# EasyEDA Pro project 高速运放.eprj

# Schematic Schematic1

## Sheets
1 P1: Create Date: 2023-07-20; Page Name: P1; Project Name: 高速运放; Schematic Name: Schematic1; Update Date: 2023-07-20; Company: 嘉立创EDA; Page Size: A4; Version: V1.0
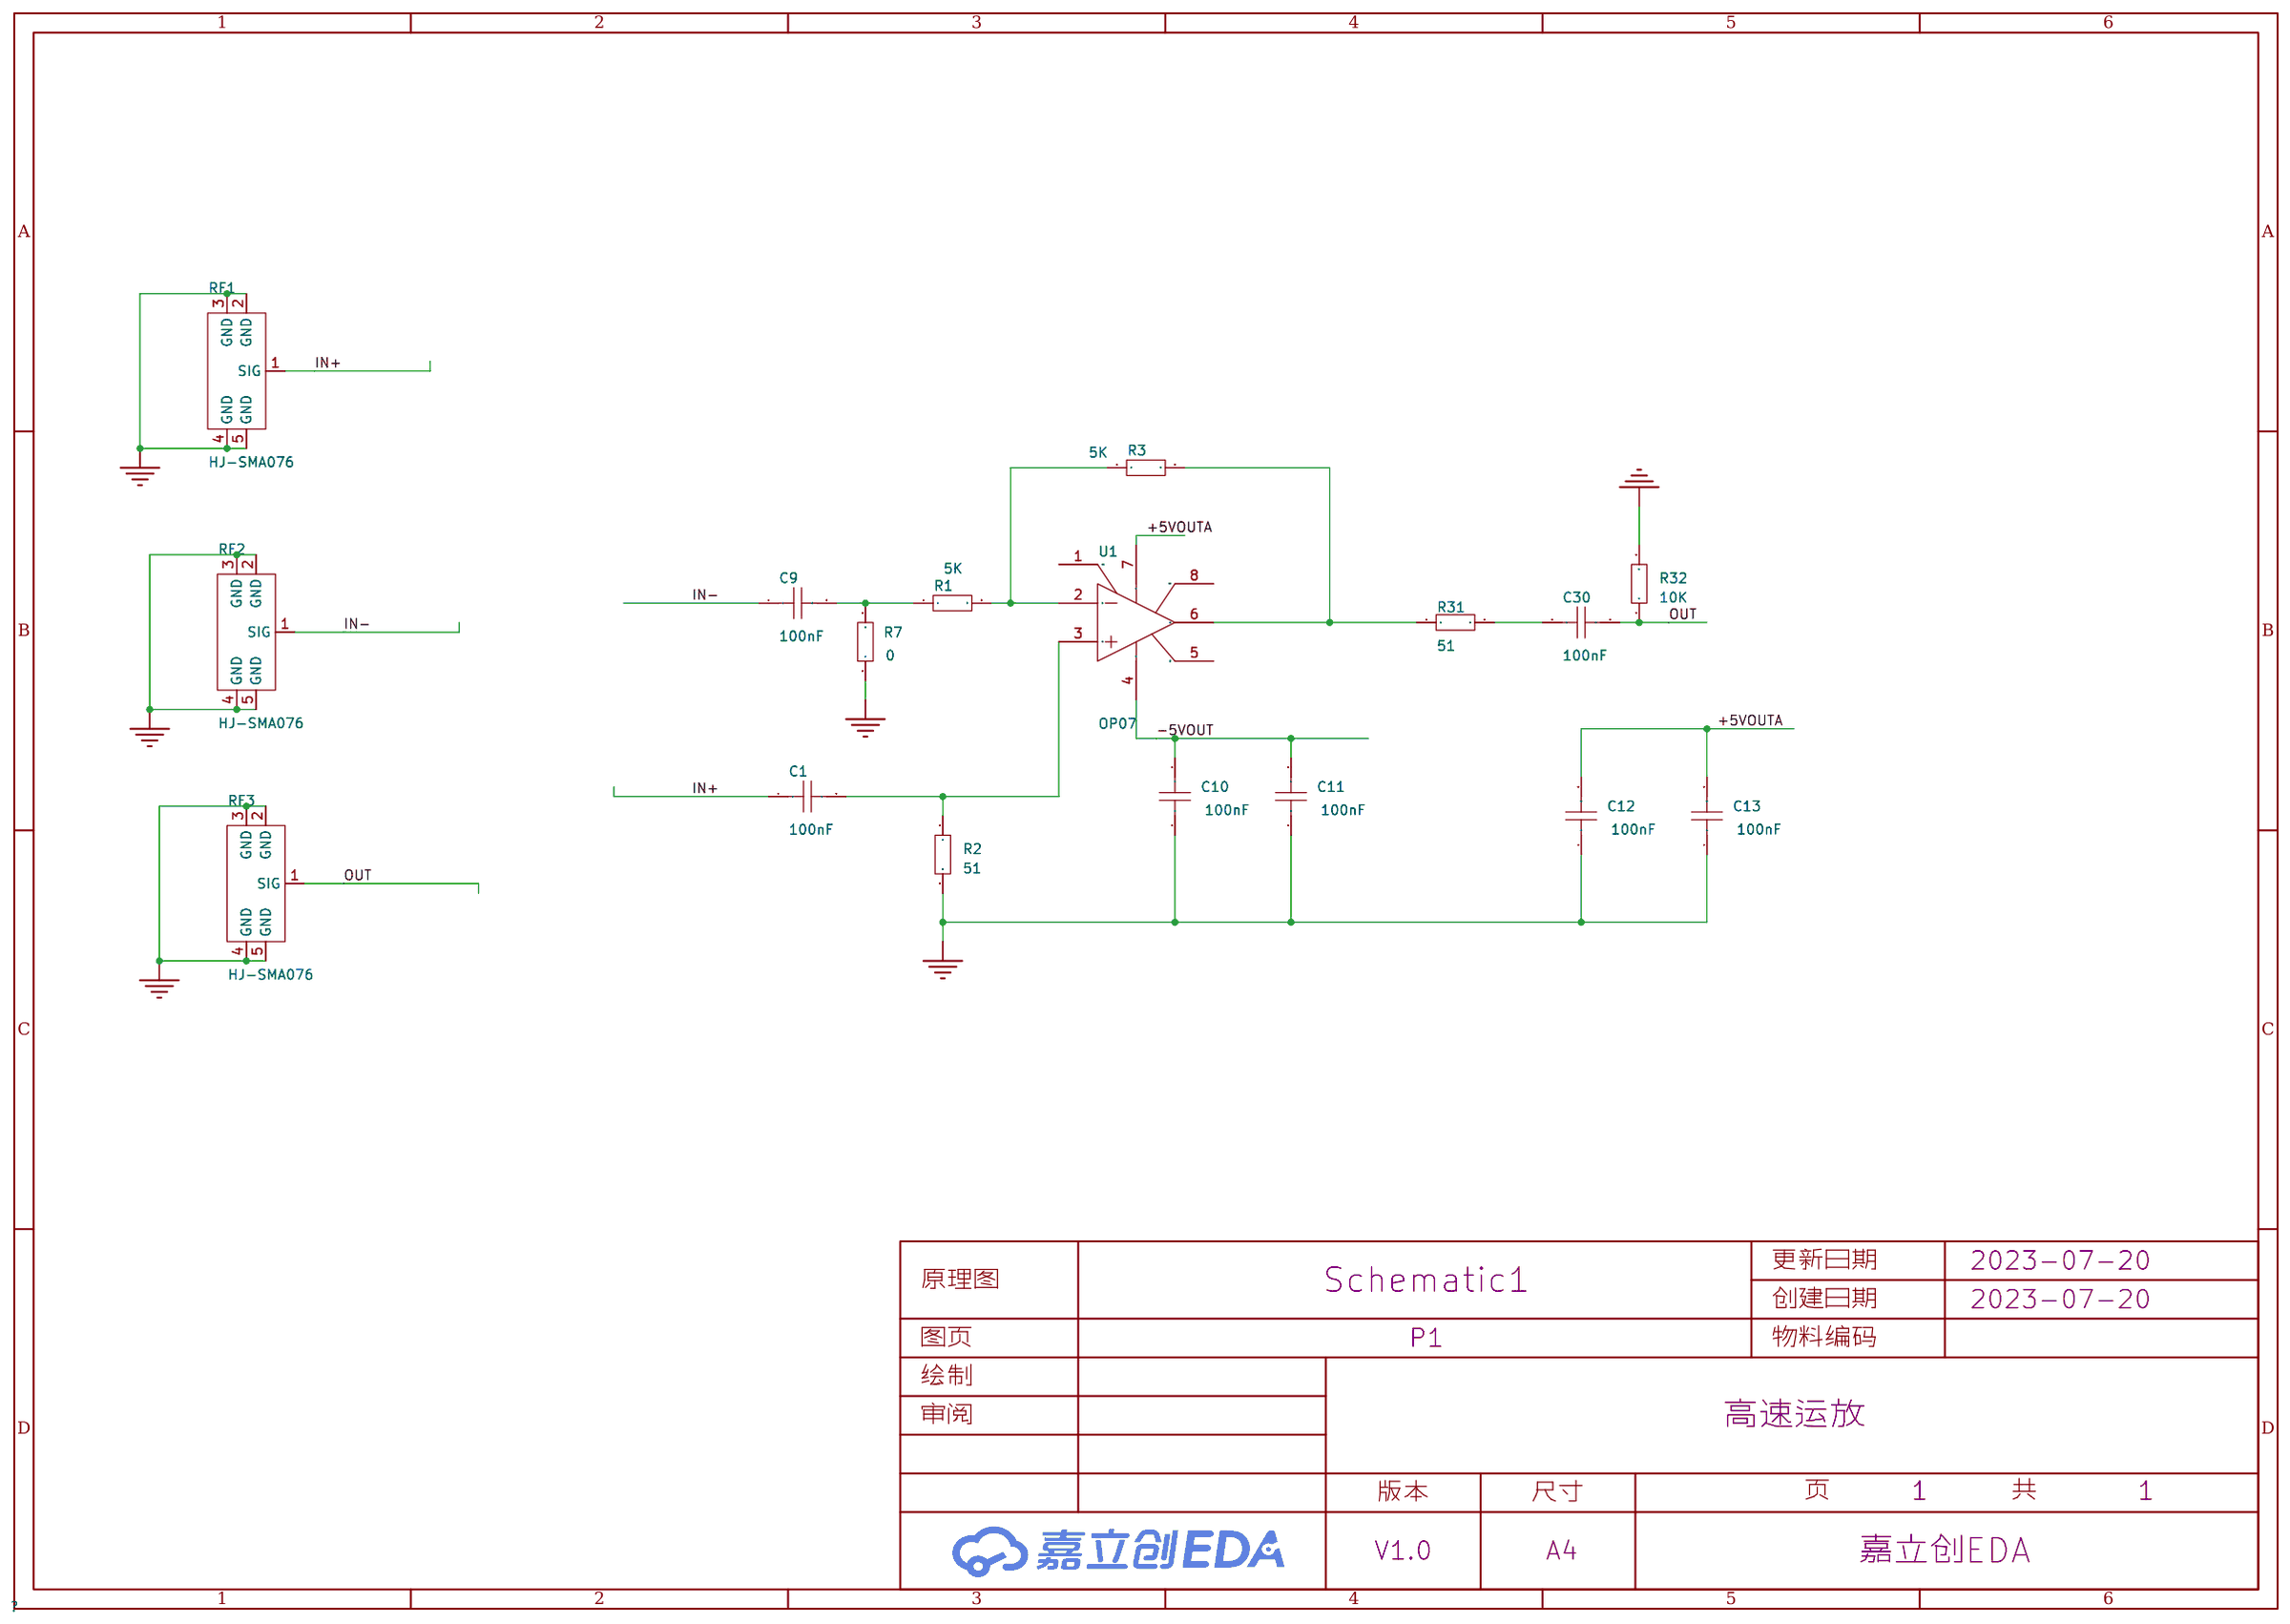
[diagram p0: P1]
2 power双: Page Name: power双
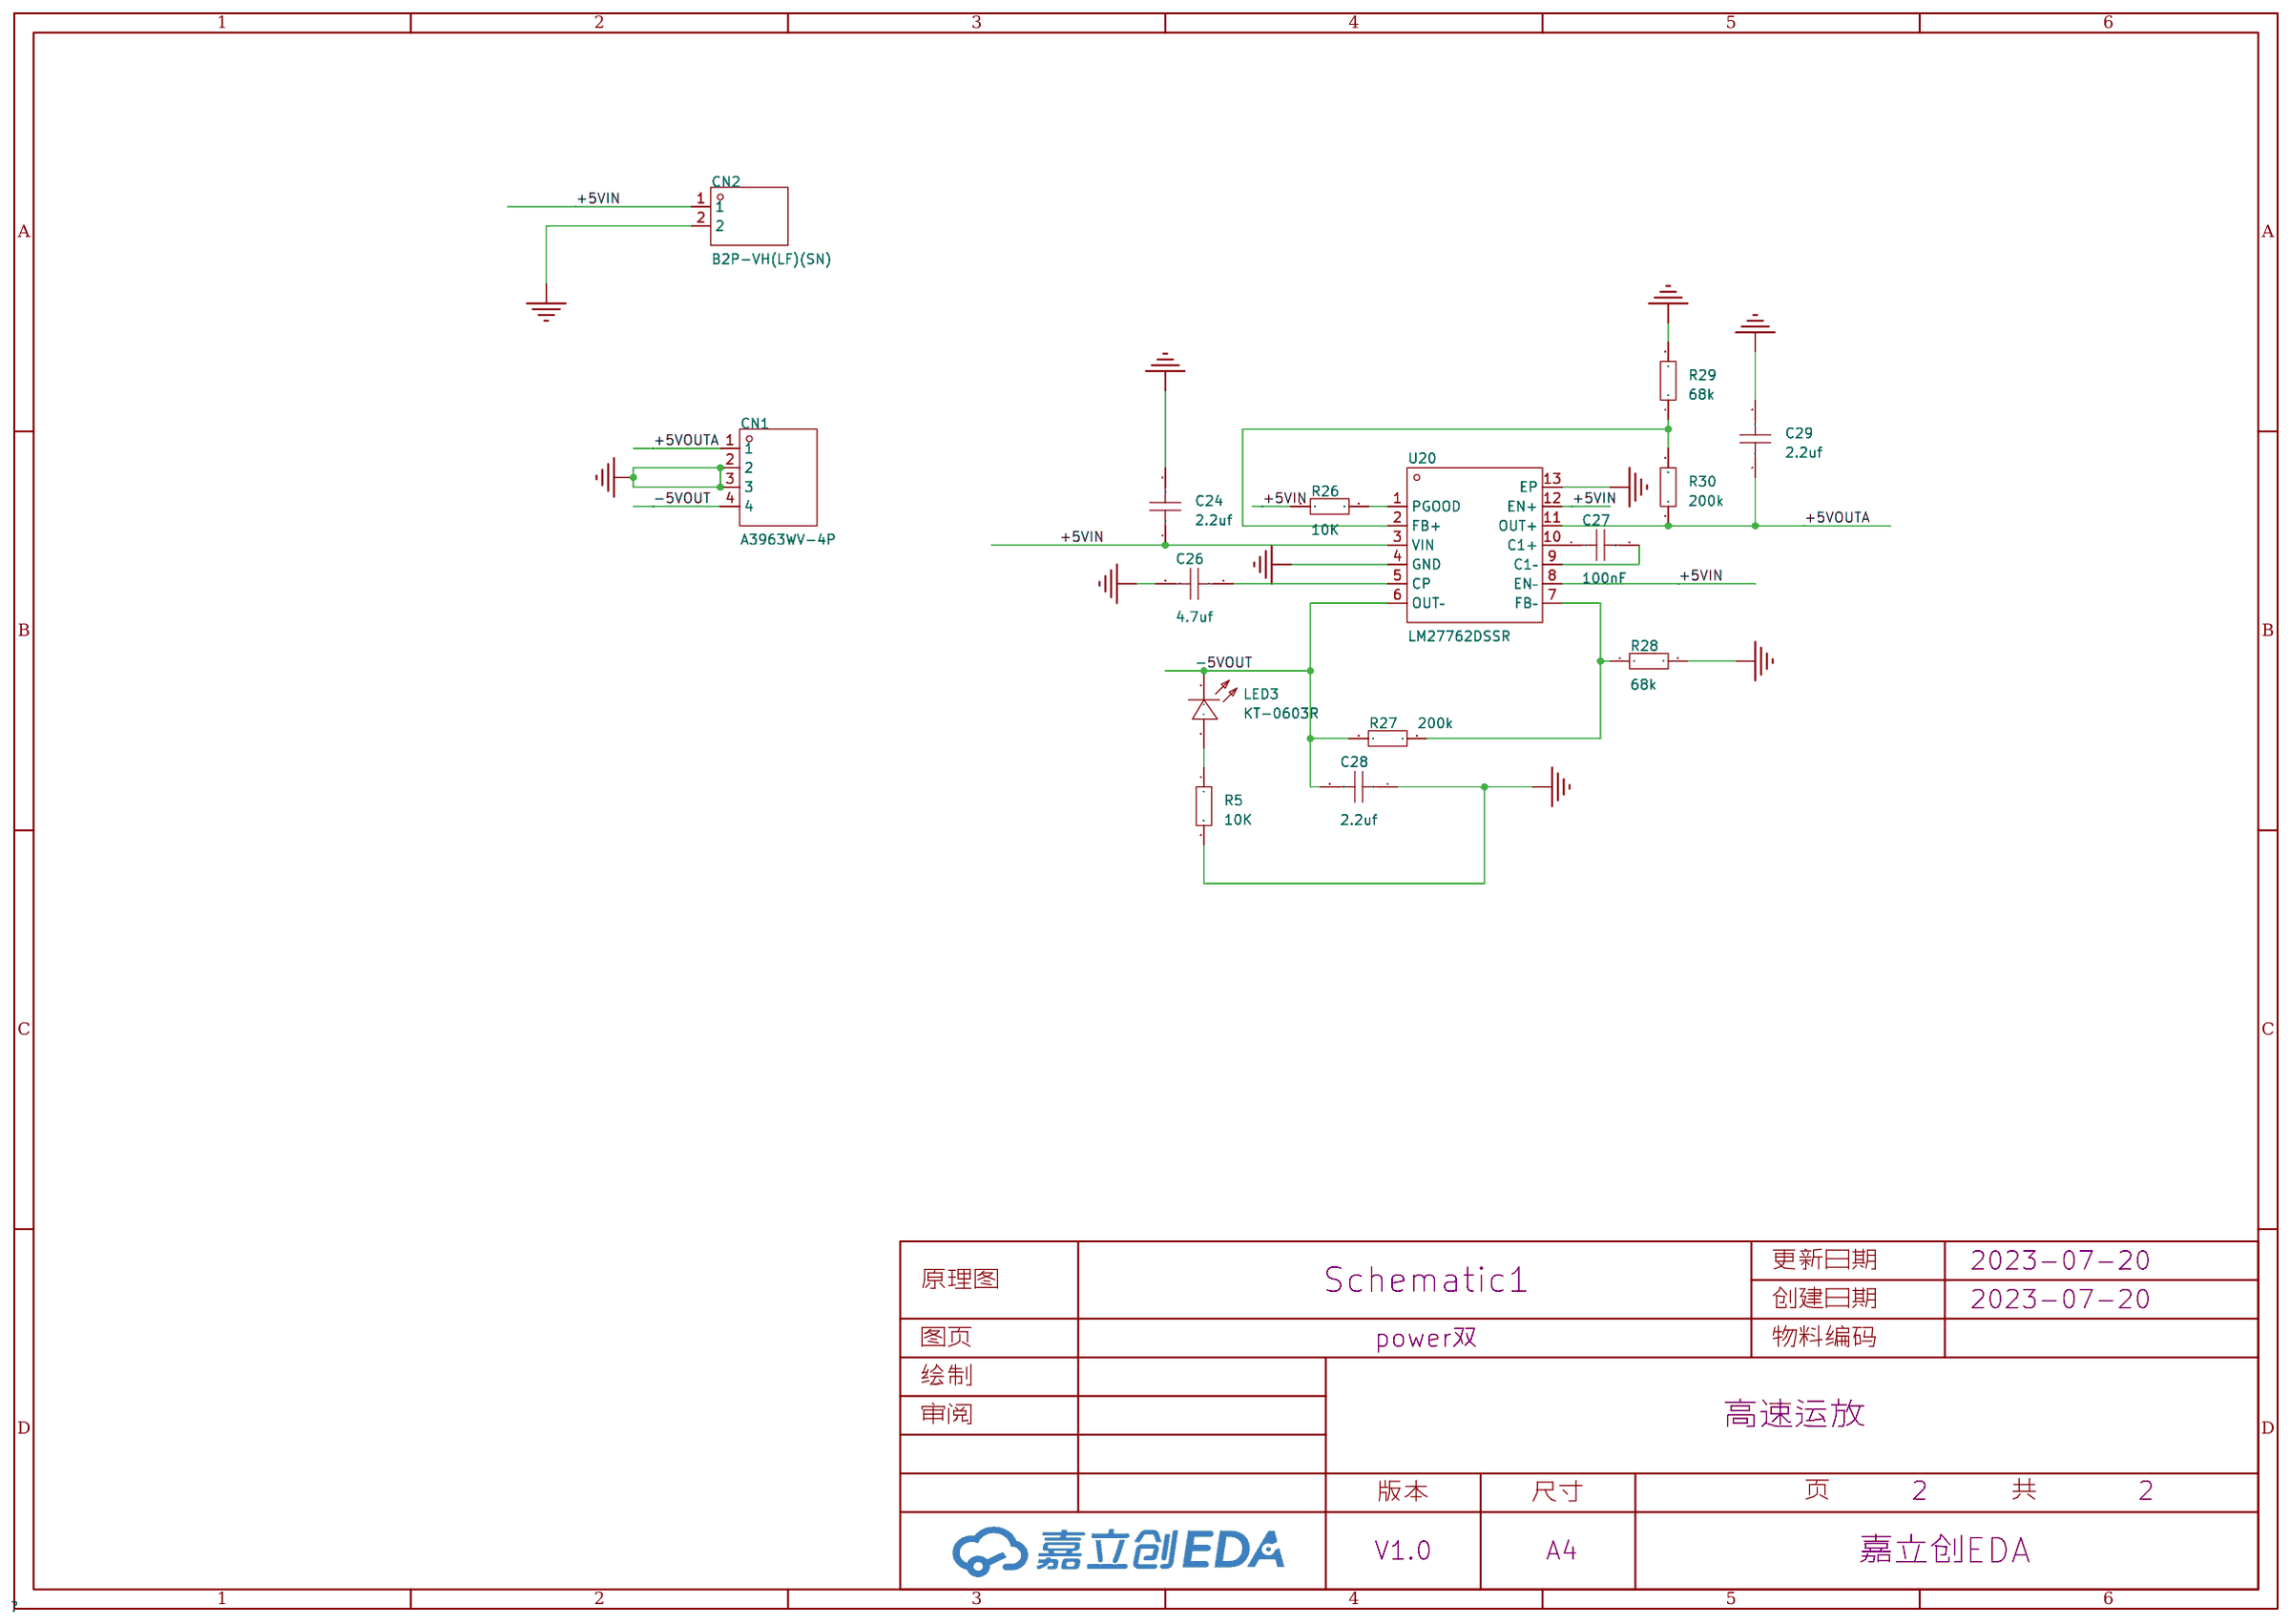
[diagram p1: power双]
3 P3: Create Date: 2023-08-04
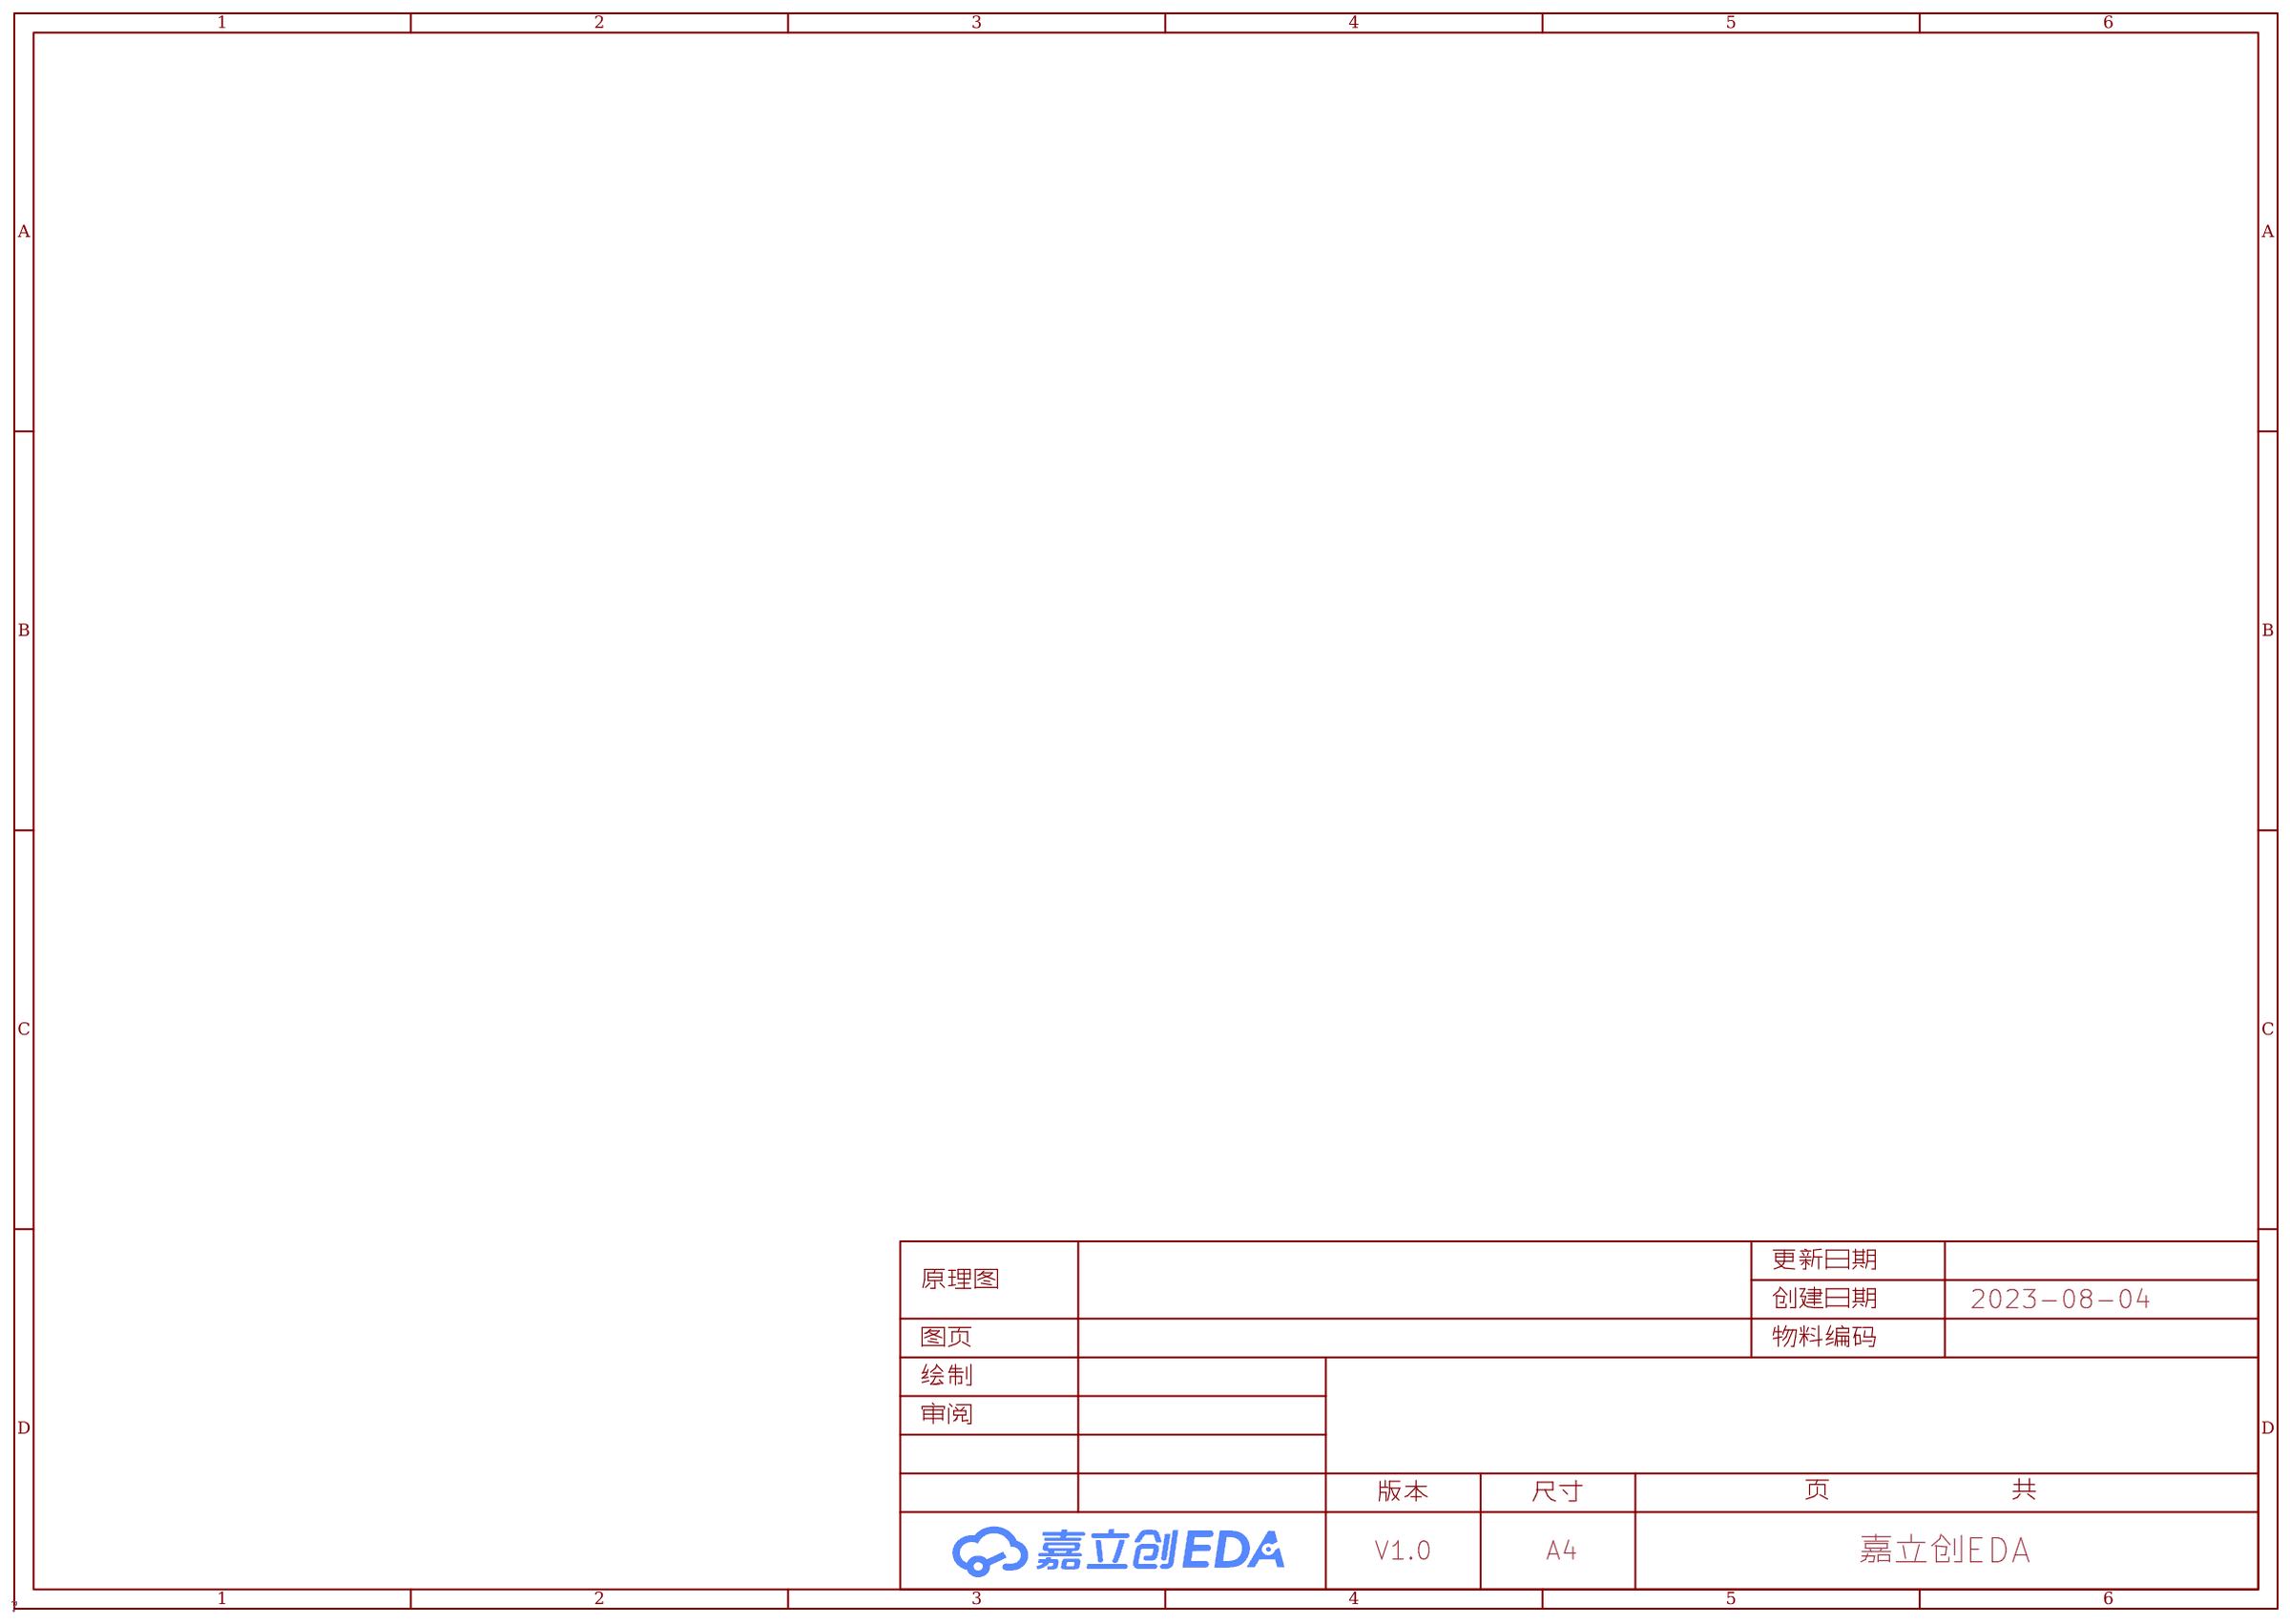
[diagram p2: P3]

## Parts
sheet P1
C1  100nF  [C0603]
C9  100nF  [C0603]
C10  100nF  [C0603]
C11  100nF  [C0603]
C12  100nF  [C0603]
C13  100nF  [C0603]
C30  100nF  [C0603]
R1  5K  [R0603]
R2  51  [R0603]
R3  5K  [R0603]
R7  0  [R0603]
R31  51  [R0603]
R32  10K  [R0603]
RF1  HJ-SMA076  [SMA-SMD_HJ-SMA076]
RF2  HJ-SMA076  [SMA-SMD_HJ-SMA076]
RF3  HJ-SMA076  [SMA-SMD_HJ-SMA076]
U1  OP07  [SOP-8_L4.9-W3.9-P1.27-LS6.0-BL]
sheet power双
C24  2.2uf  [C0603]
C26  4.7uf  [C0603]
C27  100nF  [C0603]
C28  2.2uf  [C0603]
C29  2.2uf  [C0603]
CN1  A3963WV-4P  [CONN-TH_A3963WV-4P]
CN2  B2P-VH(LF)(SN)  [CONN-TH_B2P-VH-LF-SN]
LED3  KT-0603R  [LED0603-RD]
R5  10K  [R0603]
R26  10K  [R0603]
R27  200k  [R0603]
R28  68k  [R0603]
R29  68k  [R0603]
R30  200k  [R0603]
U20  LM27762DSSR  [WSON-12_L3.0-W2.0-P0.50-BL-EP]

## Library data of the parts
C1 C9-C13 C24 C26-C30 = CAP_0603: Supplier Footprint: 0603
R1-R3 R5 R7 R26-R32 = Res_0603: Supplier Footprint: 0603
RF1-RF3 = HJ-SMA076: 连接器类型:板端;射频系列:SMA;接口类型:内孔;端口数量:1;阻抗:-;频率-最大值:-;样式:偏脚;接口直径:-;接口长度/高度:-;工作温度范围:-;; LCSC Part Name: SMA 内孔 偏脚 异形SMA母头母针; Supplier Part: C1509221; Manufacturer: 皇捷; Supplier Footprint: 插件; JLCPCB Part Class: 扩展库; Datasheet: https://atta.szlcsc.com/upload/public/pdf/source/20201224/C1509221_82B8BEE71B057F9D96B3EC7FCC7602D2.pdf; Supplier: LCSC; Connector Type: 板端; RF Series: SMA; Interface Type: 内孔; Number of Ports: 1; Style: 偏脚
U1 = OP07: 放大器组数:-;; Supplier Part: C1508997; Manufacturer: 杭州瑞盟; Supplier Footprint: SOP-8; JLCPCB Part Class: 扩展库; Datasheet: https://atta.szlcsc.com/upload/public/pdf/source/20201221/C1508997_31DB1D3DFE7BEFB064DC1C62AA82E0AA.pdf; Supplier: LCSC
CN1 = A3963WV-4P: 参考系列:VH;间距:3.96mm;插针结构:1x4P;排数:1;每排PIN数:4;行距:-;安装方式:-;触头材质:黄铜;; LCSC Part Name: VH 3.96mm 1x4P; Supplier Part: C239411; Manufacturer: CJT(长江连接器); Supplier Footprint: 直插,P=3.96mm; JLCPCB Part Class: Extended Part; Datasheet: https://atta.szlcsc.com/upload/public/pdf/source/20180725/C239411_2B583D17F8A06D9E72A993AEB9CC7416.pdf; Supplier: LCSC; Reference Series: VH; Pitch: 3.96mm; Pins Structure: 1x4P; Number of Rows: 1; Number of PINs Per Row: 4; Contact Material: 黄铜
CN2 = B2P-VH (LF)(SN): 参考系列:VH;间距:3.96mm;插针结构:1x2P;排数:1;每排PIN数:2;行距:-;安装方式:-;触头材质:黄铜;; LCSC Part Name: VH 3.96mm 1x2P 直插; Supplier Part: C160315; Manufacturer: JST; Supplier Footprint: 插件,P=3.96mm; JLCPCB Part Class: Extended Part; Datasheet: https://atta.szlcsc.com/upload/public/pdf/source/20180420/C160315_19C451141449BB9E1CAF8D49BAD03192.pdf; Supplier: LCSC; Reference Series: VH; Pitch: 3.96mm; Pins Structure: 1x2P; Number of Rows: 1; Number of PINs Per Row: 2; Contact Material: 黄铜
LED3 = KT-0603R: 发光颜色:红灯;二极管配置:-;透镜颜色:-;主波长:-;色温:-;功率:-;发光角度:-;安装方式:-;工作温度:-40℃~+85℃;; LCSC Part Name: 0603 红灯 高亮; Supplier Part: C2286; Manufacturer: KENTO; Supplier Footprint: 0603; JLCPCB Part Class: 基础库; Datasheet: https://atta.szlcsc.com/upload/public/pdf/source/20160616/1466072038404.pdf; Supplier: LCSC; Emitted Color: 红灯; Operating Temperature: -40℃~+85℃
U20 = LM27762DSSR: 功能类型:电荷泵;同步整流:否;输出通道数:2;拓扑结构:-;输入电压:2.7V~5.5V;输出电压:-5V~-1.5V；1.5V~5V;输出电流(最大值):250mA;开关频率:2.3MHz;; LCSC Part Name: 电荷泵 Vin=2.7V~5.5V Vout=1.5V~5V Vout=-5V~-1.5V 250mA; Supplier Part: C473398; Manufacturer: TI(德州仪器); Supplier Footprint: WSON-12; JLCPCB Part Class: 扩展库; Datasheet: https://atta.szlcsc.com/upload/public/pdf/source/20200102/C473398_D2E7C41775171187D808CA6E0151F4D2.pdf; Supplier: LCSC; Function: 电荷泵; Synchronous Rectification: 否; Number of Outputs: 2; Input Voltage: 2.7V~5.5V; Output Voltage: -5V~-1.5V；1.5V~5V; Output Current (Max): 250mA; Switching Frequency: 2.3MHz

## Nets
+5VIN: C24.1 CN2.1 R26.1 U20.3(VIN) U20.8(EN–) U20.12(EN+)
+5VOUTA: C12.2 C13.2 C29.1 CN1.1 R30.1 U1.7(V+) U20.11(OUT+)
-5VOUT: C10.2 C11.2 C28.2 CN1.4 LED3.1(K) R27.1 U1.4(V-) U20.6(OUT–)
GND: C10.1 C11.1 C12.1 C13.1 C24.2 C26.2 C28.1 C29.2 CN1.2 CN1.3 CN2.2 R2.2 R5.2 R7.1 R28.2 R29.2 R32.2 RF1.2(GND) RF1.3(GND) RF1.4(GND) RF1.5(GND) RF2.2(GND) RF2.3(GND) RF2.4(GND) RF2.5(GND) RF3.2(GND) RF3.3(GND) RF3.4(GND) RF3.5(GND) U20.4(GND) U20.13(EP)
IN+: C1.1 RF1.1(SIG)
IN-: C9.1 RF2.1(SIG)
OUT: C30.2 R32.1 RF3.1(SIG)
$1N351: C9.2 R1.1 R7.2
$1N845: C30.1 R31.1
$2N500: C26.1 U20.5(CP)
$2N501: C27.1 U20.10(C1+)
$2N502: C27.2 U20.9(C1–)
$2N513: R29.1 R30.2 U20.2(FB+)
$2N514: R26.2 U20.1(PGOOD)
$2N519: R27.2 R28.1 U20.7(FB–)
$2N525: LED3.2(A) R5.1
Net-(C1-2): C1.2 R2.1 U1.3(IN+)
Net-(R1-2): R1.2 R3.1 U1.2(IN-)
Net-(R3-2): R3.2 R31.2 U1.6(OUT)

Not connected (* = marked no-connect by the designer): U1 1(VOS TRIM) 5(NC) 8(VOS TRIM)

# Board PCB1
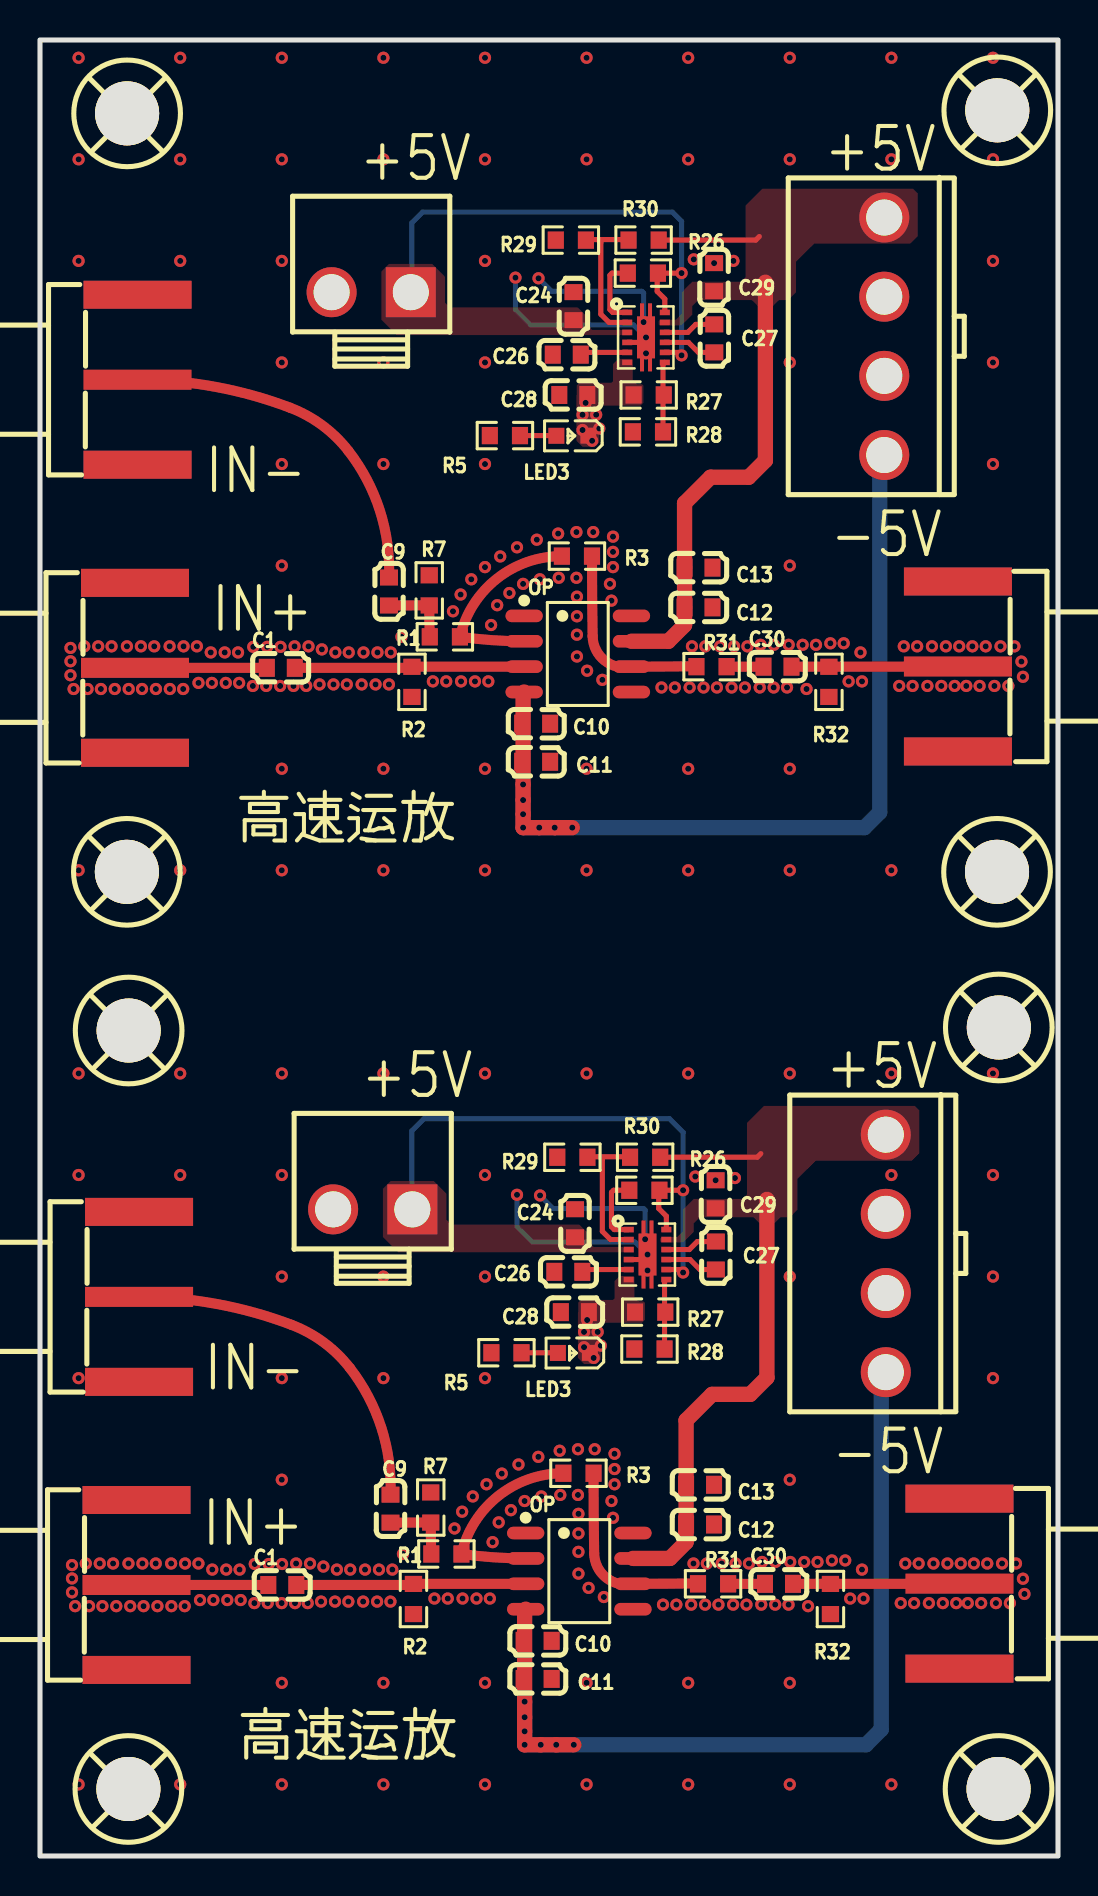
[diagram p3: board, top side]
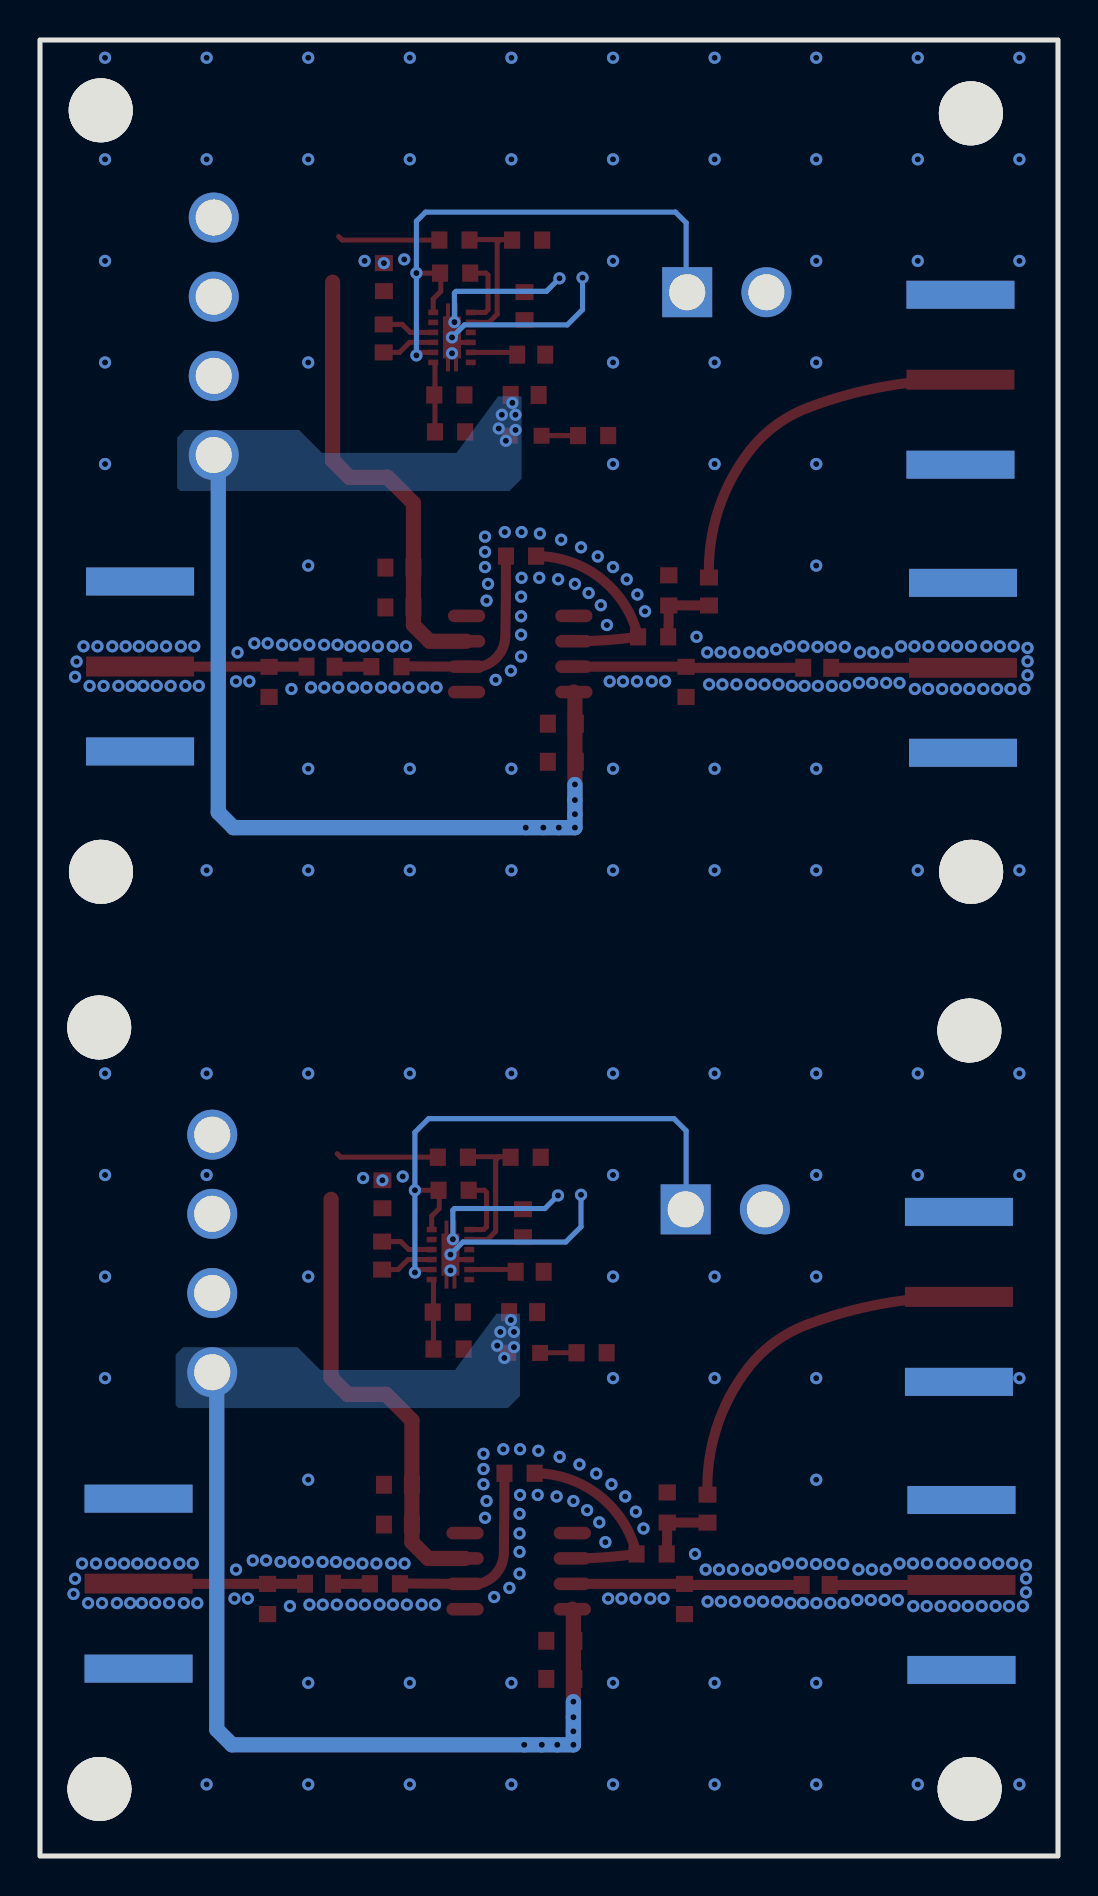
[diagram p4: board, bottom side, seen from below]

Outline 50.9 x 90.83 mm; copper layers: Top Layer, Bottom Layer. Coordinates in mm from the lower left corner of the outline.
Outline path: rectangle 0,90.83 50.9,0
Stack: Top Layer 0.035mm / Dielectric1 1.51mm FR4 er 4.5 / Bottom Layer 0.035mm

## Design rules (mm)
template: 自定义配置
spacing copperThickness1oz (default): track to track 0.102, other pairs 0.152 to 0.3
spacing copperThickness2oz: track to track 0.203, other pairs 0.152 to 0.3
track width copperThickness1oz (default): min 0.127, default 0.254, max 2.54
track width copperThickness2oz: min 0.203, default 0.254, max 2.54
differential pair differentialPair (default): width min 0.127, default 0.254, max 2.54; gap min 0.152, default 0.152
via viaSize (default): diameter min 0.5, default 0.61, max 10; hole min 0.3, default 0.305, max 6.299

## Placement (name value [footprint] x y rotation side)
C1  100nF  [C0603]  12.12 13.56 0 top
C1#2  -  [C0603]  12.04 59.43 0 top
C9  100nF  [C0603]  17.53 17.37 270 top
C9#2  -  [C0603]  17.45 63.25 270 top
C10  100nF  [C0603]  24.88 10.76 180 top
C10#2  -  [C0603]  24.81 56.64 180 top
C11  100nF  [C0603]  24.88 8.86 180 top
C11#2  -  [C0603]  24.81 54.73 180 top
C12  100nF  [C0603]  33 16.58 180 top
C12#2  -  [C0603]  32.93 62.45 180 top
C13  100nF  [C0603]  32.93 64.44 180 top
C13#2  -  [C0603]  33 18.57 180 top
C24  2.2uf  [C0603]  26.75 31.65 90 top
C24#2  -  [C0603]  26.68 77.52 90 top
C26  4.7uf  [C0603]  26.42 29.22 180 top
C26#2  -  [C0603]  26.34 75.09 180 top
C27  100nF  [C0603]  33.79 30.03 270 top
C27#2  -  [C0603]  33.72 75.9 270 top
C28  2.2uf  [C0603]  26.74 27.2 0 top
C28#2  -  [C0603]  26.67 73.08 0 top
C29  2.2uf  [C0603]  33.78 33.1 90 top
C29#2  -  [C0603]  33.71 78.97 90 top
C30  100nF  [C0603]  36.87 59.49 0 top
C30#2  -  [C0603]  36.95 13.61 0 top
CN1  A3963WV-4P  [CONN-TH_A3963WV-4P]  42.29 30.14 270 top
CN1#2  -  [CONN-TH_A3963WV-4P]  42.22 76.01 270 top
CN2  B2P-VH(LF)(SN)  [CONN-TH_B2P-VH-LF-SN]  16.64 32.34 180 top
CN2#2  -  [CONN-TH_B2P-VH-LF-SN]  16.56 78.22 180 top
LED3  KT-0603R  [LED0603-RD]  26.7 25.16 180 top
LED3#2  -  [LED0603-RD]  26.62 71.04 180 top
OP  -  [SOP-8_L4.9-W3.9-P1.27-LS6.0-BL]  26.89 60.12 270 top
OP#2  -  [SOP-8_L4.9-W3.9-P1.27-LS6.0-BL]  26.97 14.25 270 top
R1  5K  [R0603]  20.24 60.98 0 top
R1#2  -  [R0603]  20.32 15.11 0 top
R2  51  [R0603]  18.67 12.85 270 top
R2#2  -  [R0603]  18.6 58.73 270 top
R3  5K  [R0603]  26.92 19.14 0 top
R3#2  -  [R0603]  26.85 65.02 0 top
R5  10K  [R0603]  23.32 25.17 180 top
R5#2  -  [R0603]  23.25 71.04 180 top
R7  0  [R0603]  19.54 17.43 270 top
R7#2  -  [R0603]  19.46 63.3 270 top
R26  10K  [R0603]  30.15 79.17 180 top
R26#2  -  [R0603]  30.22 33.3 180 top
R27  200k  [R0603]  30.44 73.08 0 top
R27#2  -  [R0603]  30.51 27.2 0 top
R28  68k  [R0603]  30.47 25.36 180 top
R28#2  -  [R0603]  30.4 71.23 180 top
R29  68k  [R0603]  26.62 34.95 180 top
R29#2  -  [R0603]  26.54 80.82 180 top
R30  200k  [R0603]  30.26 34.95 180 top
R30#2  -  [R0603]  30.18 80.82 180 top
R31  51  [R0603]  33.58 59.49 180 top
R31#2  -  [R0603]  33.66 13.61 180 top
R32  10K  [R0603]  39.45 58.73 270 top
R32#2  -  [R0603]  39.52 12.85 270 top
RF1  HJ-SMA076  [SMA-SMD_HJ-SMA076]  4.75 59.43 90 top
RF1#2  -  [SMA-SMD_HJ-SMA076]  4.83 13.56 90 top
RF2  HJ-SMA076  [SMA-SMD_HJ-SMA076]  4.88 73.84 90 top
RF2#2  -  [SMA-SMD_HJ-SMA076]  4.95 27.97 90 top
RF3  HJ-SMA076  [SMA-SMD_HJ-SMA076]  45.9 59.5 270 top
RF3#2  -  [SMA-SMD_HJ-SMA076]  45.97 13.62 270 top
TP1  -  [M3螺丝]  47.99 3.29 0 top
TP1#2  -  [M3螺丝]  4.48 3.29 0 top
TP1#3  -  [M3螺丝]  4.5 41.22 0 top
TP1#4  -  [M3螺丝]  4.42 87.1 0 top
TP1#5  -  [M3螺丝]  4.41 49.16 0 top
TP1#6  -  [M3螺丝]  47.92 49.16 0 top
TP2  -  [M3螺丝]  48.01 41.38 0 top
TP2#2  -  [M3螺丝]  47.93 87.25 0 top
U20  LM27762DSSR  [WSON-12_L3.0-W2.0-P0.50-BL-EP]  30.3 75.95 270 top
U20#2  -  [WSON-12_L3.0-W2.0-P0.50-BL-EP]  30.38 30.08 270 top

## Footprints (pads in the part's own frame, mm; a bottom-side part is the same pattern mirrored in y, then rotated)
C0603
  rect 0.8x0.9 smd: 1(-0.7,0) 2(0.7,0)
CONN-TH_A3963WV-4P
  round 2.5 hole 1.8: 1(-5.94,0) 2(-1.98,0) 3(1.98,0) 4(5.94,0)
CONN-TH_B2P-VH-LF-SN
  rect 2.5x2.5 hole 1.8: 1(-1.98,0)
  round 2.5 hole 1.8: 2(1.98,0)
LED0603-RD
  rect 0.8x0.8 smd: 1(-0.799,-0.004) 2(0.799,0.004)
M3螺丝
  round 3.2 hole 3.2: 1(-0.064,0.064)
R0603
  rect 0.806x0.864 smd: 1(-0.753,0) 2(0.753,0)
SMA-SMD_HJ-SMA076
  rect 1x5.4 smd: 1(0,0)
  rect 1.4x5.4 smd: 2(-4.25,0) 3(4.25,0)
  rect 1.4x5.4 smd far side: 4(-4.25,0) 5(4.25,0)
SOP-8_L4.9-W3.9-P1.27-LS6.0-BL
  oval 0.63x1.865 smd: 1(-1.905,-2.683) 2(-0.635,-2.683) 3(0.635,-2.683) 4(1.905,-2.683) 5(1.905,2.683) 6(0.635,2.683) 7(-0.635,2.683) 8(-1.905,2.683)
WSON-12_L3.0-W2.0-P0.50-BL-EP
  rect 0.28x0.5 smd: 1(-1.25,-0.94) 2(-0.75,-0.94) 3(-0.25,-0.94) 4(0.25,-0.94) 5(0.75,-0.94) 6(1.25,-0.94) 7(1.25,0.94) 8(0.75,0.94) 9(0.25,0.94) 10(-0.25,0.94) 11(-0.75,0.94) 12(-1.25,0.94)
  custom 3.4x0.9 smd: 13(0,0)

## Nets
+5VIN: C24.1 C24#2.1 CN2.1 CN2#2.1 R26.1 R26#2.1 U20.3 U20.8 U20.12 U20#2.3 U20#2.8 U20#2.12
+5VOUTA: C12.2 C12#2.2 C13.2 C13#2.2 C29.1 C29#2.1 CN1.1 CN1#2.1 OP.7 OP#2.7 R30.1 R30#2.1 U20.11 U20#2.11
-5VOUT: C10.2 C10#2.2 C11.2 C11#2.2 C28.2 C28#2.2 CN1.4 CN1#2.4 LED3.1 LED3#2.1 OP.4 OP#2.4 R27.1 R27#2.1 U20.6 U20#2.6
GND: C10.1 C10#2.1 C11.1 C11#2.1 C12.1 C12#2.1 C13.1 C13#2.1 C24.2 C24#2.2 C26.2 C26#2.2 C28.1 C28#2.1 C29.2 C29#2.2 CN1.2 CN1.3 CN1#2.2 CN1#2.3 CN2.2 CN2#2.2 R2.2 R2#2.2 R5.2 R5#2.2 R7.1 R7#2.1 R28.2 R28#2.2 R29.2 R29#2.2 R32.2 R32#2.2 RF1.2 RF1.3 RF1.4 RF1.5 RF1#2.2 RF1#2.3 RF1#2.4 RF1#2.5 RF2.2 RF2.3 RF2.4 RF2.5 RF2#2.2 RF2#2.3 RF2#2.4 RF2#2.5 RF3.2 RF3.3 RF3.4 RF3.5 RF3#2.2 RF3#2.3 RF3#2.4 RF3#2.5 U20.4 U20.13 U20#2.4 U20#2.13
IN+: C1.1 C1#2.1 RF1.1 RF1#2.1
IN-: C9.1 C9#2.1 RF2.1 RF2#2.1
OUT: C30.2 C30#2.2 R32.1 R32#2.1 RF3.1 RF3#2.1
$1N351: C9.2 C9#2.2 R1.1 R1#2.1 R7.2 R7#2.2
$1N353: C1.2 C1#2.2 OP.3 OP#2.3 R2.1 R2#2.1
$1N484: OP.2 OP#2.2 R1.2 R1#2.2 R3.1 R3#2.1
$1N492: OP.6 OP#2.6 R3.2 R3#2.2 R31.2 R31#2.2
$1N845: C30.1 C30#2.1 R31.1 R31#2.1
$2N500: C26.1 C26#2.1 U20.5 U20#2.5
$2N501: C27.1 C27#2.1 U20.10 U20#2.10
$2N502: C27.2 C27#2.2 U20.9 U20#2.9
$2N513: R29.1 R29#2.1 R30.2 R30#2.2 U20.2 U20#2.2
$2N514: R26.2 R26#2.2 U20.1 U20#2.1
$2N519: R27.2 R27#2.2 R28.1 R28#2.1 U20.7 U20#2.7
$2N525: LED3.2 LED3#2.2 R5.1 R5#2.1

Pads without a net: OP 1 5 8; OP#2 1 5 8; TP1 1; TP1#2 1; TP1#3 1; TP1#4 1; TP1#5 1; TP1#6 1; TP2 1; TP2#2 1

## Via types
v1: diameter 0.61, hole 0.305, Top Layer to Bottom Layer, 400 vias

## Routing (per net, layer and track width the routed paths; a pad name or vN(x,y) marks a point on that pad's centre or on a via; arc(x,y) is an arc through that point)
+5VIN: length 57.6
  Top Layer w0.254: v1(32.16,29.18) 32.01,29.33 U20#2.8 ; U20.12 31.24,77.88 30.86,78.26 30.86,79.13 R26.1 32.08,79.17 ; 32.16,33.3 R26#2.1 30.94,33.26 30.94,32.38 31.32,32 U20#2.12 ; U20.8 31.93,75.2 v1(32.08,75.06)
  Bottom Layer w0.254: CN2#2.1 18.59,78.27 18.59,81.69 19.13,82.22 31.62,82.22 32.08,81.76 v1(32.08,79.17) v1(32.08,75.06) ; CN2.1 18.59,32.37 18.59,36.27 19.2,36.88 31.47,36.88 32.16,36.19 v1(32.16,33.3) v1(32.16,29.18)
+5VOUTA: length 56.1
  Top Layer w0.254: 35.97,81 35.79,80.82 R30#2.1 ; R30.1 35.87,34.95 36.04,35.13
  Top Layer w0.762: 36.35,32.84 36.35,23.93 35.51,23.09 33.6,23.09 32.31,21.79 C13#2.2 C12.2 32.31,15.69 31.5,14.88 OP#2.7 ; 36.27,78.71 36.27,69.8 35.43,68.96 33.53,68.96 32.23,67.66 C13.2 C12#2.2 32.23,61.57 31.42,60.76 29.57,60.76
-5VOUT: length 102
  Top Layer w0.503: C11#2.2 C10#2.2 24.11,58.12 24.16,58.16 ; C11.2 C10.2 24.18,12.24 24.23,12.29
  Top Layer w0.762: v1(26.69,5.56) v1(25.81,5.56) v1(25.04,5.56) v1(24.23,5.56) v1(24.23,6.24) v1(24.23,6.94) v1(24.23,7.72) 24.23,12.29 OP#2.4 ; v1(26.61,51.43) v1(25.74,51.43) v1(24.96,51.43) v1(24.16,51.43) v1(24.16,52.11) v1(24.16,52.81) v1(24.16,53.59) 24.16,58.16 OP.4
  Bottom Layer w0.762: v1(24.16,53.59) v1(24.16,52.81) v1(24.16,52.11) v1(24.16,51.43) v1(24.96,51.43) v1(25.74,51.43) v1(26.61,51.43) 41.22,51.43 41.99,52.2 41.99,69.84 CN1#2.4 ; CN1.4 42.06,23.97 42.06,6.32 41.3,5.56 v1(26.69,5.56) v1(25.81,5.56) v1(25.04,5.56) v1(24.23,5.56) v1(24.23,6.24) v1(24.23,6.94) v1(24.23,7.72)
  vias: v1(27.13,72.09) v1(27.13,71.32) v1(27.2,26.21) v1(27.2,25.45) v1(27.28,72.68) v1(27.36,26.81) v1(27.61,70.78) v1(27.68,24.91) v1(27.81,72.09) v1(27.89,26.21) v1(27.97,71.4) v1(28.04,25.53)
GND: length 33.5
  Top Layer w0.254: U20.4 30.05,75.7 v1(30.3,75.95) ; v1(30.38,30.08) 30.13,29.83 U20#2.4
  Bottom Layer w0.254: v1(24.93,78.91) 25.58,78.26 30.1,78.26 30.18,78.18 v1(30.18,76.72) ; v1(30.38,30.08) 29.75,30.71 24.61,30.71 23.85,31.47 v1(23.85,33.07) ; v1(30.26,30.85) 30.26,32.3 30.18,32.38 25.66,32.38 v1(25,33.04) ; v1(30.3,75.95) 29.68,76.58 24.54,76.58 23.77,77.34 v1(23.77,78.94)
  vias: v1(1.52,60.42) v1(1.52,59.76) v1(1.52,59.06) v1(1.6,14.55) v1(1.6,13.88) v1(1.6,13.19) v1(1.68,58.37) v1(1.76,12.5) v1(1.93,89.94) v1(1.93,84.86) v1(1.93,79.78) v1(1.93,49.3) v1(1.93,39.14) v1(1.93,34.06) v1(1.93,23.9) v1(1.93,3.58) v1(2.21,60.5) v1(2.29,14.63) v1(2.38,58.37) v1(2.45,12.5) v1(2.91,60.5) v1(2.99,14.63) v1(3.04,58.37) v1(3.12,12.5) v1(3.58,60.5) v1(3.74,58.37) v1(3.65,14.63) v1(3.81,12.5) v1(4.35,60.5) v1(4.43,58.37) v1(4.42,14.63) v1(4.51,12.5) v1(5.04,60.5) v1(5.1,58.37) v1(5.12,14.63) v1(5.18,12.5) v1(5.71,60.5) v1(5.8,58.37) v1(5.79,14.63) v1(5.87,12.5) v1(6.48,60.5) v1(6.49,58.37) v1(6.56,14.63) v1(6.57,12.5) v1(7.01,89.94) v1(7.01,84.86) v1(7.01,79.78) v1(7.01,49.3) v1(7.01,39.14) v1(7.01,34.06) v1(7.01,3.58) v1(7.18,60.5) v1(7.16,58.37) v1(7.24,12.5) v1(7.25,14.63) v1(7.84,60.5) v1(7.93,58.67) v1(7.92,14.63) v1(8,12.8) v1(8.54,60.2) v1(8.59,58.67) v1(8.61,14.33) v1(8.67,12.8) v1(9.24,60.2) v1(9.29,58.67) v1(9.31,14.33) v1(9.37,12.8) v1(9.9,60.2) v1(9.96,58.67) v1(9.98,14.33) v1(10.03,12.8) v1(10.64,58.52) v1(10.66,60.48) v1(10.74,14.6) v1(10.72,12.65) v1(11.31,58.52) v1(11.36,60.48) v1(11.44,14.6) v1(11.39,12.65) v1(12.03,60.48) v1(12.01,58.52) v1(12.09,89.94) v1(12.09,84.86) v1(12.09,79.78) v1(12.09,74.7) v1(12.09,69.62) v1(12.09,64.54) v1(12.09,54.38) v1(12.09,49.3) v1(12.09,39.14) v1(12.09,34.06) v1(12.09,28.98) v1(12.09,23.9) v1(12.09,18.82) v1(12.1,14.6) v1(12.08,12.65) v1(12.09,8.66) v1(12.09,3.58) v1(12.73,60.5) v1(12.67,58.52) v1(12.81,14.63) v1(12.75,12.65) v1(13.31,58.52) v1(13.43,60.5) v1(13.39,12.65) v1(13.5,14.63) v1(13.98,58.6) v1(14.09,60.35) v1(14.05,12.73) v1(14.17,14.48) v1(14.67,58.6) v1(14.77,60.2) v1(14.75,12.73) v1(14.84,14.33) v1(15.34,58.6) v1(15.44,60.2) v1(15.42,12.73) v1(15.51,14.33) v1(16.08,58.6) v1(16.18,60.2) v1(16.16,12.73) v1(16.25,14.33) v1(16.78,58.6) v1(16.87,60.2) v1(16.86,12.73) v1(16.95,14.33) v1(17.17,89.94) v1(17.17,84.86) v1(17.17,74.7) v1(17.17,69.62) v1(17.17,54.38) v1(17.17,49.3) v1(17.17,39.14) v1(17.17,28.98) v1(17.17,23.9) v1(17.17,8.66) v1(17.17,3.58) v1(17.54,60.2) v1(17.45,58.6) v1(17.52,12.73) v1(17.62,14.33) v1(18.07,60.98) v1(18.15,15.11) v1(19.65,58.75) v1(19.72,12.88) v1(20.31,58.75) v1(20.39,12.88) v1(20.65,62.26) v1(20.73,16.38) v1(21.03,63.09) v1(21.05,58.75) v1(21.11,17.22) v1(21.13,12.88) v1(21.56,63.86) v1(21.64,17.98) v1(21.75,58.75) v1(21.83,12.88) v1(22.25,89.94) v1(22.25,84.86) v1(22.25,79.78) v1(22.25,74.7) v1(22.25,69.62) v1(22.25,64.47) v1(22.25,54.38) v1(22.25,49.3) v1(22.25,39.14) v1(22.25,34.06) v1(22.25,28.98) v1(22.25,23.9) v1(22.33,18.59) v1(22.25,8.66) v1(22.25,3.58) v1(22.42,58.75) v1(22.49,12.88) v1(22.56,61.57) v1(22.63,15.7) v1(22.86,62.56) v1(22.94,16.69) v1(23.01,65) v1(23.09,19.13) v1(23.47,63.17) v1(23.55,17.3) v1(23.85,65.46) v1(23.93,19.58) v1(24.16,63.63) v1(24.23,17.75) v1(24.84,65.84) v1(24.92,19.96) v1(24.99,63.86) v1(25.07,17.98) v1(25.91,66.14) v1(25.94,63.93) v1(25.98,20.27) v1(26.02,18.06) v1(26.82,66.22) v1(26.82,63.93) v1(26.85,62.99) v1(26.85,62.01) v1(26.85,61.09) v1(26.85,59.99) v1(26.9,20.35) v1(26.9,18.06) v1(26.92,17.12) v1(26.92,16.13) v1(26.92,15.21) v1(26.92,14.12) v1(27.33,89.94) v1(27.33,84.86) v1(27.33,54.38) v1(27.33,49.3) v1(27.33,39.14) v1(27.33,8.66) v1(27.33,3.58) v1(27.36,59.28) v1(27.43,13.41) v1(27.66,66.22) v1(27.74,20.35) v1(28.12,58.83) v1(28.19,12.95) v1(28.5,63.63) v1(28.57,62.79) v1(28.57,17.75) v1(28.65,65.99) v1(28.65,65.23) v1(28.65,64.47) v1(28.73,20.12) v1(28.73,19.35) v1(28.73,18.59) v1(28.65,16.92) v1(30.3,75.16) v1(30.38,29.29) v1(31.08,58.45) v1(31.15,12.57) v1(31.74,58.45) v1(31.82,12.57) v1(32.41,89.94) v1(32.41,84.86) v1(32.41,54.38) v1(32.41,49.3) v1(32.41,39.14) v1(32.41,8.66) v1(32.41,3.58) v1(32.48,58.45) v1(32.6,60.5) v1(32.56,12.57) v1(32.69,79.86) v1(32.68,14.63) v1(32.77,33.99) v1(33.18,58.45) v1(33.27,60.5) v1(33.34,14.63) v1(33.26,12.57) v1(33.71,79.67) v1(33.78,33.8) v1(33.85,58.45) v1(33.92,12.57) v1(34.01,60.5) v1(34.08,14.63) v1(34.58,58.45) v1(34.67,79.78) v1(34.7,60.5) v1(34.66,12.57) v1(34.75,33.91) v1(34.78,14.63) v1(35.25,58.45) v1(35.32,12.57) v1(35.37,60.5) v1(35.45,14.63) v1(36.03,60.58) v1(35.99,58.45) v1(36.1,14.71) v1(36.06,12.57) v1(36.7,60.58) v1(36.69,58.45) v1(36.77,14.71) v1(36.76,12.57) v1(37.44,60.58) v1(37.35,58.45) v1(37.43,12.57) v1(37.49,89.94) v1(37.49,84.86) v1(37.49,74.7) v1(37.49,64.54) v1(37.49,54.38) v1(37.49,49.3) v1(37.49,39.14) v1(37.49,28.98) v1(37.49,18.82) v1(37.51,14.71) v1(37.49,8.66) v1(37.49,3.58) v1(38.13,60.58) v1(38.21,14.71) v1(38.33,58.37) v1(38.41,12.5) v1(38.8,60.58) v1(38.88,14.71) v1(39.52,60.66) v1(39.6,14.78) v1(40.19,60.66) v1(40.26,14.78) v1(40.43,58.75) v1(40.51,12.88) v1(41.02,60.2) v1(41.1,58.75) v1(41.1,14.33) v1(41.18,12.88) v1(42.57,89.94) v1(42.57,84.86) v1(42.57,49.3) v1(42.57,39.14) v1(42.57,34.06) v1(42.57,3.58) v1(42.96,58.52) v1(43.04,12.65) v1(43.19,60.5) v1(43.27,14.63) v1(43.63,58.52) v1(43.71,12.65) v1(43.86,60.5) v1(43.93,14.63) v1(44.37,58.52) v1(44.45,12.65) v1(44.6,60.5) v1(44.68,14.63) v1(45.07,58.52) v1(45.14,12.65) v1(45.3,60.5) v1(45.37,14.63) v1(45.73,58.52) v1(45.81,12.65) v1(45.96,60.5) v1(46.04,14.63) v1(46.32,58.52) v1(46.39,12.65) v1(46.62,60.5) v1(46.7,14.63) v1(46.98,58.52) v1(47.06,12.65) v1(47.29,60.5) v1(47.36,14.63) v1(47.65,89.94) v1(47.65,84.86) v1(47.65,79.78) v1(47.65,74.7) v1(47.65,69.62) v1(47.72,58.52) v1(47.65,39.14) v1(47.65,34.06) v1(47.65,28.98) v1(47.65,23.9) v1(47.8,12.65) v1(48.03,60.5) v1(48.1,14.63) v1(48.42,58.52) v1(48.5,12.65) v1(48.72,60.5) v1(48.8,14.63) v1(49.07,59.74) v1(49.15,58.98) v1(49.15,13.87) v1(49.23,13.11)
IN+: length 13.2
  Top Layer w0.503: RF1#2.1 C1.1 ; RF1.1 C1#2.1
IN-: length 36.5
  Top Layer w0.503: C9.1 arc(17.07,21.42) 15.49,24.41 arc(14.18,25.69) 12.57,26.57 arc(8.83,27.61) RF2#2.1 ; RF2.1 arc(8.75,73.49) 12.5,72.44 arc(14.11,71.56) 15.42,70.28 arc(16.99,67.29) C9#2.1
OUT: length 16.7
  Top Layer w0.503: C30.2 45.89,59.49 RF3.1 ; C30#2.2 45.97,13.61 RF3#2.1
$1N351: length 7.2
  Top Layer w0.503: C9#2.2 arc(18.46,62.55) 19.46,62.55 ; R7#2.2 arc(19.47,61.76) R1.1 ; C9.2 arc(18.53,16.68) 19.54,16.68 ; R7.2 arc(19.55,15.89) R1#2.1
$1N353: length 23
  Top Layer w0.503: OP#2.3 18.68,13.61 R2.1 18.62,13.56 12.82,13.56 ; OP.3 18.6,59.49 R2#2.1 18.55,59.43 C1#2.2
$1N484: length 20.5
  Top Layer w0.503: OP#2.2 arc(22.68,14.94) R1#2.2 arc(22.92,18.01) R3.1 ; R3#2.1 arc(22.84,63.88) R1.2 arc(22.6,60.81) 24.21,60.76
$1N492: length 20.2
  Top Layer w0.503: 32.9,13.64 arc(31.28,13.62) OP#2.6 arc(28.32,13.91) 27.71,15.14 arc(27.69,17.14) R3.2 ; 32.83,59.51 arc(31.2,59.49) OP.6 arc(28.24,59.79) 27.63,61.01 arc(27.61,63.01) R3#2.2
$1N845: length 3.7
  Top Layer w0.503: R31#2.1 arc(35.33,13.61) 36.25,13.61 ; R31.1 arc(35.25,59.49) 36.17,59.48
$2N500: length 4.7
  Top Layer w0.254: C26#2.1 27.15,75.2 U20.5 ; C26.1 27.23,29.33 U20#2.5
$2N501: length 5.3
  Top Layer w0.254: C27#2.1 32.79,76.6 32.39,76.2 U20.10 ; U20#2.10 32.47,30.33 32.87,30.73 C27.1
$2N502: length 5.4
  Top Layer w0.254: C27#2.2 32.92,75.2 32.42,75.7 U20.9 ; C27.2 33,29.33 32.5,29.83 U20#2.9
$2N513: length 14.9
  Top Layer w0.254: R29#2.1 27.32,80.85 27.89,80.85 ; R30#2.2 29.4,80.85 27.89,80.85 ; U20.2 28.45,76.7 28.04,77.11 28.04,80.7 27.89,80.85 ; 27.97,34.98 28.12,34.82 28.12,31.24 28.53,30.83 U20#2.2 ; 27.97,34.98 29.48,34.98 R30.2 ; 27.97,34.98 27.4,34.98 R29.1
$2N514: length 7.2
  Top Layer w0.254: R26.2 28.6,79.17 28.5,79.07 28.5,77.34 28.64,77.2 U20.1 ; U20#2.1 28.71,31.33 28.57,31.47 28.57,33.19 28.68,33.3 R26#2.2
$2N519: length 7.1
  Top Layer w0.254: 31.15,73.04 R27.2 ; 31.15,73.04 31.15,74.62 U20.7 ; 31.15,73.04 R28#2.1 ; U20#2.7 31.23,28.74 31.23,27.17 ; 31.23,27.17 R27#2.2 ; 31.23,27.17 R28.1
$2N525: length 3.6
  Top Layer w0.254: R5.1 25.89,25.17 25.9,25.16 ; LED3#2.2 25.81,71.04 R5#2.1

## Copper pours and planes (outline as drawn; the poured copper is in the pictures)
+5VIN on Top Layer: 17.15,33.76 29.59,33.76 29.59,30.2 17.15,30.2
+5VIN on Top Layer: 17.07,79.63 29.51,79.63 29.51,76.07 17.07,76.07
+5VOUTA on Top Layer: 35.43,32.54 37.11,32.54 37.11,31.27 35.43,31.27
+5VOUTA on Top Layer: 31.01,37.52 43.97,37.52 43.97,30.69 31.01,30.69
+5VOUTA on Top Layer: 35.36,78.41 37.03,78.41 37.03,77.15 35.36,77.15
+5VOUTA on Top Layer: 30.94,83.39 43.89,83.39 43.89,76.56 30.94,76.56
-5VOUT on Top Layer: 26.9,29 30.25,29 30.25,24.61 26.9,24.61
-5VOUT on Top Layer: 26.82,74.88 30.18,74.88 30.18,70.48 26.82,70.48
-5VOUT on Bottom Layer: 26.82,73 44.04,73 44.04,68.28 26.82,68.28
-5VOUT on Bottom Layer: 26.9,27.13 44.12,27.13 44.12,22.4 26.9,22.4
GND on Top Layer: -23.62,99.97 72.77,99.97 72.77,-17.75 -23.62,-17.75
GND on Bottom Layer: -17.53,96.62 64.16,96.62 64.16,-14.02 -17.53,-14.02

## Text on the board
Top Silkscreen Layer: IN+ | IN- | +5V | -5V | 高速运放
